# Altium schematic sheet Com_PC.SchDoc
size 276 x 198 mm; SheetNumber: 3; SheetTotal: 6
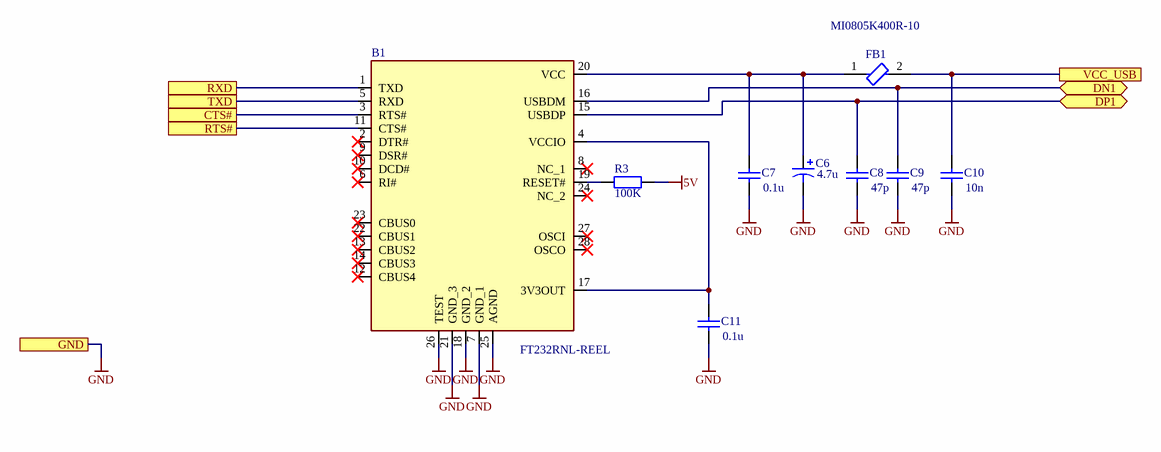
[diagram p0: Com_PC.SchDoc]

## Parts
B1  FT232RNL-REEL  [SOP65P780X200-28N]
C6  4.7u  [PCAP_SVP_A5_PAN-M]
C7  0.1u  [C0805]
C8  47p  [C0805]
C9  47p  [C0805]
C10  10n  [C0805]
C11  0.1u  [C0805]
FB1  MI0805K400R-10  [FP-MI0805-MFG]
R3  100K  [RESC2012X06M]

## Ports
CTS#, DN1 (bidir), DP1 (bidir), GND, RTS#, RXD, TXD, VCC_USB

## Nets
5V: R3.1
GND: B1.7(GND_1) B1.18(GND_2) B1.21(GND_3) B1.25(AGND) B1.26(TEST) C6.2 C7.2 C8.2 C9.2 C10.2 C11.2 ; port GND
CTS#: B1.3(RTS#) ; port CTS#
DN1: B1.16(USBDM) C9.1 ; port DN1
DP1: B1.15(USBDP) C8.1 ; port DP1
RTS#: B1.11(CTS#) ; port RTS#
RXD: B1.1(TXD) ; port RXD
TXD: B1.5(RXD) ; port TXD
VCC_USB: C10.1 FB1.2 ; port VCC_USB
NetB1_4: B1.4(VCCIO) B1.17(3V3OUT) C11.1
NetB1_19: B1.19(RESET#) R3.2
NetB1_20: B1.20(VCC) C6.1 C7.1 FB1.1

Not connected (* = marked no-connect by the designer): B1 2(DTR#)* 6(RI#)* 8(NC_1)* 9(DSR#)* 10(DCD#)* 12(CBUS4)* 13(CBUS2)* 14(CBUS3)* 22(CBUS1)* 23(CBUS0)* 24(NC_2)* 27(OSCI)* 28(OSCO)*

## Notes on the sheet
- a
- Dessiné
- A4
- Echelle :
- Mod.
- b
- c
- d
- Contrôlé
- Remplace
- Nb. feuilles
- Feuille n°
- Nom du projet
- No

## Library data of the parts
B1 = FT232RNL-REEL: UART Interface IC USB Full Speed to Serial UART IC, Includes Oscillator and EEPROM, SSOP-28; Manufacturer_Name: FTDI Chip; Geometry.Height: 2mm; Manufacturer_Part_Number: FT232RNL-REEL; Mouser Part Number: 895-FT232RNL-REEL; Mouser Price/Stock: https://www.mouser.co.uk/ProductDetail/FTDI/FT232RNL-REEL?qs=By6Nw2ByBD3LSfXryh9qRQ%3D%3D; Arrow Part Number: FT232RNL-REEL; Arrow Price/Stock: https://www.arrow.com/en/products/ft232rnl-reel/ftdi-chip?utm_currency=USD&region=europe; Datasheet Link: https://ftdichip.com/wp-content/uploads/2022/12/DS_FT232RN.pdf
C6 = Cap Pol1: Polarized Capacitor (Radial); Published: 8-Jun-2000; LatestRevisionDate: 17-Jul-2002; LatestRevisionNote: Re-released for DXP Platform.; PackageReference: RB7.6-15; Publisher: Altium Limited; PackageDescription: Polarized Capacitor (Radial); 2 Leads; Value: 4.7u
C7-C11 = Cap: Capacitor; Published: 8-Jun-2000; LatestRevisionDate: 17-Jul-2002; LatestRevisionNote: Re-released for DXP Platform.; PackageReference: RAD-0.3; Publisher: Altium Limited; PackageDescription: Radial Cap, Thru-Hole; 2 Leads; 0.3 in Pin Spacing
  C7 C11: Value: 0.1u
  C8 C9: Value: 47p
  C10: Value: 10n
FB1 = CMP-2000-06702-2: FERRITE BEAD 40 OHM 0805 1LN; Impedance: 40R; Max Current Rating: 1.5A; Tolerance: 25%; Test Frequency: 100MHz; DC Resistance (DCR): 50mR; Number of Lines: 1; Min Operating Temperature: -40°C; Case/Package: 0805; Depth: 1.45mm; Current Rating: 1.5A; Width: 0.049inch; Core Material: Ferrite; Termination: SMD/SMT; Case Code (Imperial): 0805; Packaging: Tape and Reel; Weight: 0.00392oz; Lead Free: Lead Free; Length: 2mm; Max Operating Temperature: 125°C; Mount: Surface Mount; Case Code (Metric): 2012; Frequency: 100MHz; Height: 0.043inch; Package Quantity: 1; Material: Ferrite; Contact Plating: Tin; Max DC Current: 1.5A
R3 = Res2: Resistor; Published: 8-Jun-2000; LatestRevisionDate: 17-Jul-2002; LatestRevisionNote: Re-released for DXP Platform.; PackageReference: AXIAL-0.4; Publisher: Altium Limited; PackageDescription: Axial Device, Thru-Hole; 2 Leads; 0.4 in Pin Spacing; Value: 100K